# EAGLE design breakout (EAGLE 9.5.1)
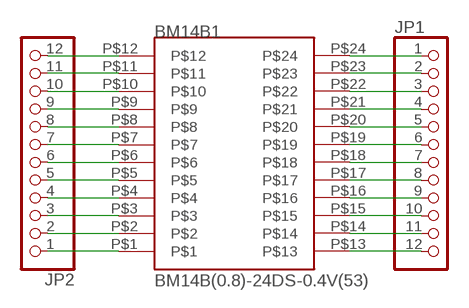
[diagram p0: schematic, sheet 1]

## Parts
BM14B1  BM14B(0.8)-24DS-0.4V(53)  [BM14B(0.8)-24DS-0.4V(53)]
JP1  PINHD-1X12  [1X12]
JP2  PINHD-1X12  [1X12]

## Nets
N$1: BM14B1.P$12 JP2.12
N$2: BM14B1.P$11 JP2.11
N$3: BM14B1.P$10 JP2.10
N$4: BM14B1.P$9 JP2.9
N$5: BM14B1.P$8 JP2.8
N$6: BM14B1.P$7 JP2.7
N$7: BM14B1.P$6 JP2.6
N$8: BM14B1.P$5 JP2.5
N$9: BM14B1.P$4 JP2.4
N$10: BM14B1.P$3 JP2.3
N$11: BM14B1.P$2 JP2.2
N$12: BM14B1.P$1 JP2.1
N$13: BM14B1.P$24 JP1.1
N$14: BM14B1.P$23 JP1.2
N$15: BM14B1.P$22 JP1.3
N$16: BM14B1.P$21 JP1.4
N$17: BM14B1.P$20 JP1.5
N$18: BM14B1.P$19 JP1.6
N$19: BM14B1.P$18 JP1.7
N$20: BM14B1.P$17 JP1.8
N$21: BM14B1.P$16 JP1.9
N$22: BM14B1.P$15 JP1.10
N$23: BM14B1.P$14 JP1.11
N$24: BM14B1.P$13 JP1.12

## Library data of the parts
BM14B1 = BM14B(0.8)-24DS-0.4V:BM14B(0.8)-24DS-0.4V(53)
JP1 JP2 = adafruit:PINHD-1X12: PIN HEADER

## Board
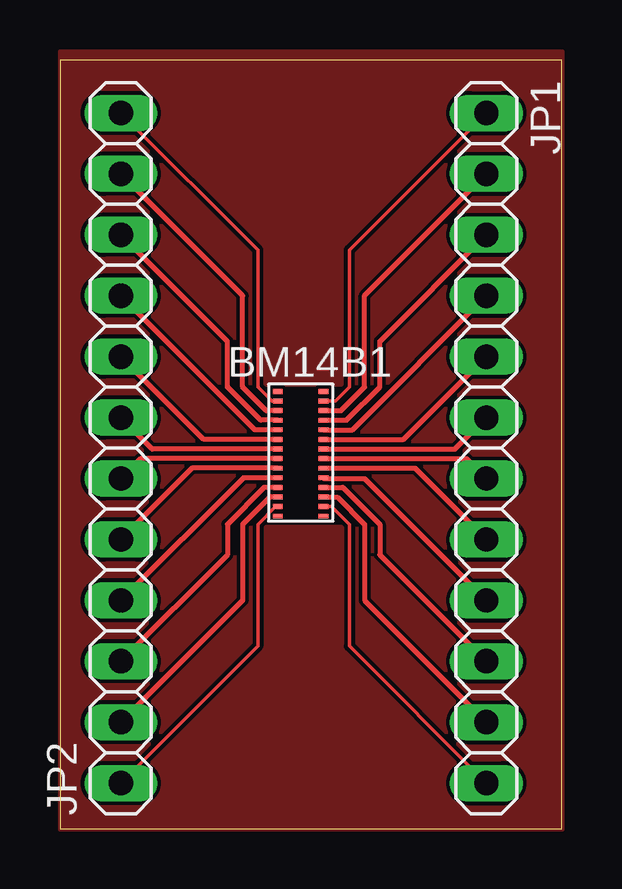
[diagram p1: board, top side]
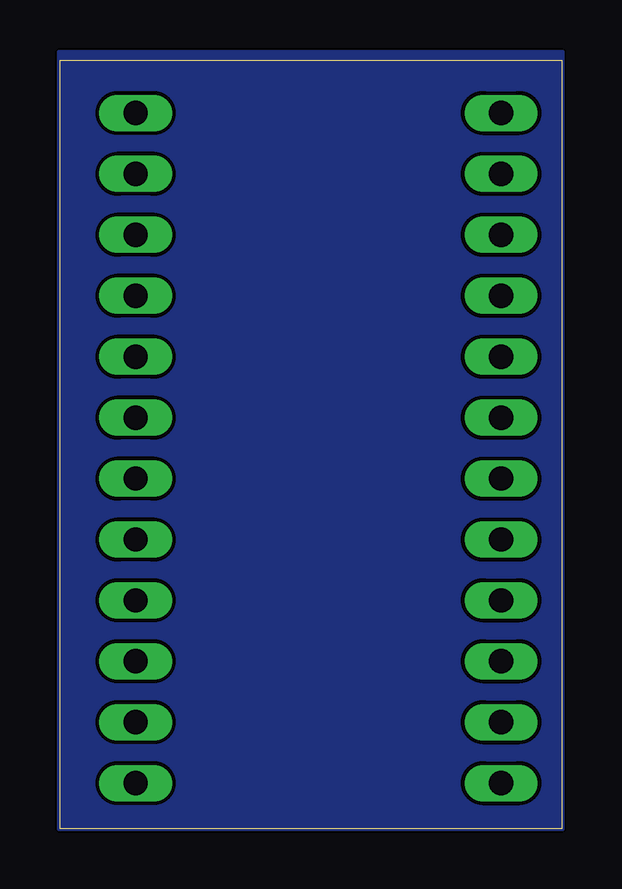
[diagram p2: board, bottom side, seen from below]

Size 20.93 x 32.05 mm. Coordinates in mm from the lower left corner, seen from the top.
Outline: 0,0 20.93,0 20.93,32.05 0,32.05 0,0
Copper layers (1*16): Top 0.035mm / dielectric 1.5mm / Bottom 0.035mm
Design rules "default *": minimum track width 6mil, minimum drill 0.35mm, track to track 6mil, track to pad 6mil, pad to pad 6mil, via to via 6mil, smd to smd 6mil, copper to edge 0mil, drill to drill 6mil, minimum pad ring 10mil, minimum via ring 8mil, stop-mask expansion 4mil, vias tented up to drill 0mil, thermal gap 10mil
tRestrict: area 8.3,12.7 to 12.1,18.4

### Footprints (pad centres in the part's own frame; a part is rotated, then mirrored left to right if it is on the bottom)
BM14B(0.8)-24DS-0.4V(53) = smd 0.4 x 0.2: P$1 0.2,0.1; P$2 0.2,0.5; P$3 0.2,0.9; P$4 0.2,1.3; P$5 0.2,1.7; P$6 0.2,2.1; P$7 0.2,2.5; P$8 0.2,2.9; P$9 0.2,3.3; P$10 0.2,3.7; P$11 0.2,4.1; P$12 0.2,4.5; P$13 2.1,0.1; P$14 2.1,0.5; P$15 2.1,0.9; P$16 2.1,1.3; P$17 2.1,1.7; P$18 2.1,2.1; P$19 2.1,2.5; P$20 2.1,2.9; P$21 2.1,3.3; P$22 2.1,3.7; P$23 2.1,4.1; P$24 2.1,4.5; P$25 0.2,4.9; P$26 2.1,4.9; P$27 0.2,-0.3; P$28 2.1,-0.3
1X12 = drill 1.016 long: 1 -13.97,0; 2 -11.43,0; 3 -8.89,0; 4 -6.35,0; 5 -3.81,0; 6 -1.27,0; 7 1.27,0; 8 3.81,0; 9 6.35,0; 10 8.89,0; 11 11.43,0; 12 13.97,0

### Placement (x,y rotation side)
BM14B1  8.89,13.34 0 top
JP1  17.78,15.88 270 top
JP2  2.54,15.88 90 top

### Tracks (layer width: path | path; a pad name or v marks a point on that pad's centre or on a via)
GND
  pour Bottom: 0,0 20.95,0 20.95,31.75 20.95,32.39 0,32.39
  pour Top: 0,0 20.95,0 20.95,32.39 0,32.39
N$1
  Top 0.152: BM14B1.P$12 8.84,17.83 8.26,18.41 8.26,24.13 JP2.12
N$2
  Top 0.203: BM14B1.P$11 8.6,17.43 7.62,18.41 7.62,22.22 JP2.11
N$3
  Top 0.203: BM14B1.P$10 8.37,17.04 6.99,18.41 6.99,20.32 JP2.10
N$4
  Top 0.203: BM14B1.P$9 8.13,16.63 JP2.9
N$5
  Top 0.203: BM14B1.P$8 5.99,16.23 JP2.8
N$6
  Top 0.203: BM14B1.P$7 3.85,15.83 JP2.7
N$7
  Top 0.203: BM14B1.P$6 3.37,15.44 JP2.6
N$8
  Top 0.203: BM14B1.P$5 5.51,15.04 JP2.5
N$9
  Top 0.203: BM14B1.P$4 7.65,14.63 JP2.4
N$10
  Top 0.203: BM14B1.P$3 8.52,14.23 6.99,12.7 6.99,11.43 JP2.3
N$11
  Top 0.203: BM14B1.P$2 8.76,13.84 7.62,12.7 7.62,9.53 JP2.2
N$12
  Top 0.152: BM14B1.P$1 8.99,13.44 8.26,12.7 8.26,7.62 JP2.1
N$13
  Top 0.152: BM14B1.P$24 11.48,17.83 12.06,18.41 12.06,24.13 JP1.1
N$14
  Top 0.203: BM14B1.P$23 11.72,17.43 12.7,18.41 12.7,22.22 JP1.2
N$15
  Top 0.203: BM14B1.P$22 11.96,17.04 13.34,18.41 13.34,20.32 JP1.3
N$16
  Top 0.203: BM14B1.P$21 12.19,16.63 JP1.4
N$17
  Top 0.203: BM14B1.P$20 14.33,16.23 JP1.5
N$18
  Top 0.203: BM14B1.P$19 16.47,15.83 JP1.6
N$19
  Top 0.203: BM14B1.P$18 16.95,15.44 JP1.7
N$20
  Top 0.203: BM14B1.P$17 14.81,15.04 JP1.8
N$21
  Top 0.203: BM14B1.P$16 11.02,14.61 12.7,14.61 JP1.9
N$22
  Top 0.203: BM14B1.P$15 11.8,14.23 13.34,12.7 13.34,11.43 JP1.10
N$23
  Top 0.203: BM14B1.P$14 11.56,13.84 12.7,12.7 12.7,9.53 JP1.11
N$24
  Top 0.152: BM14B1.P$13 11.33,13.44 12.06,12.7 12.06,7.62 JP1.12